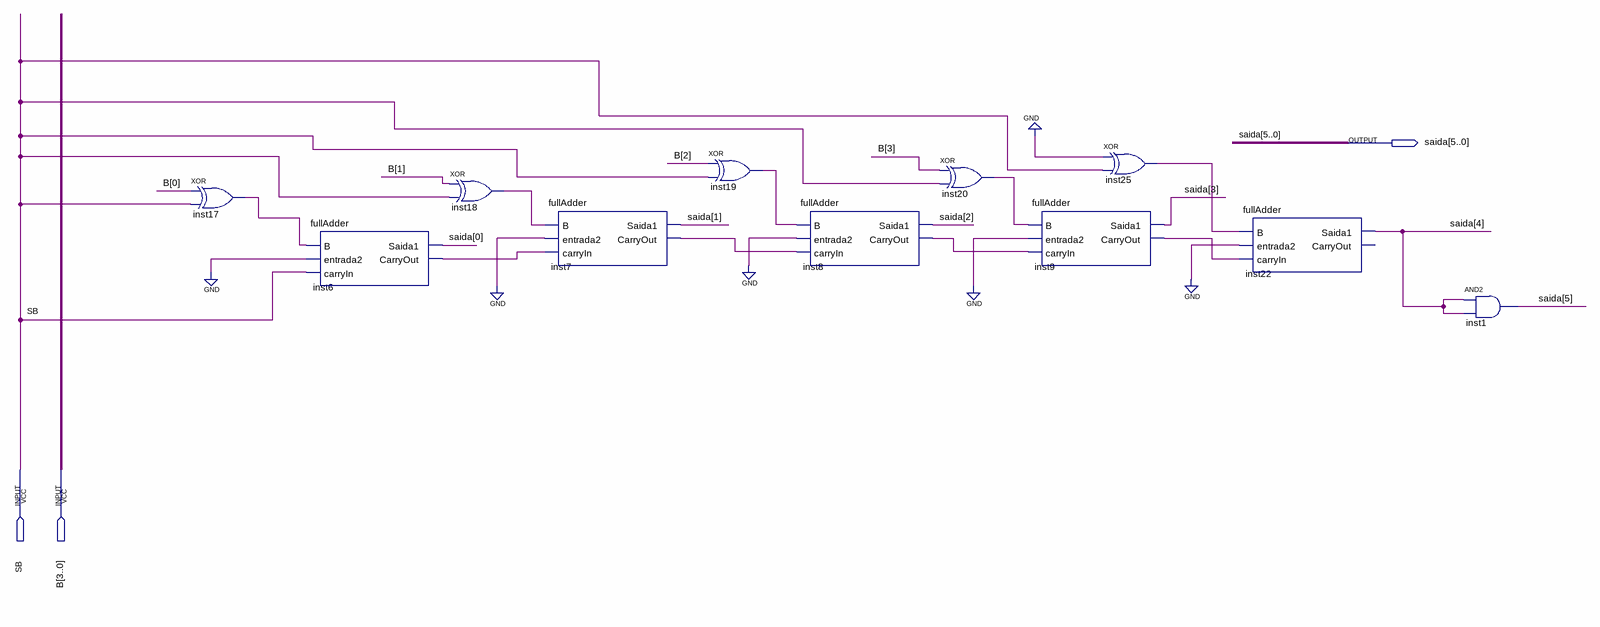
[diagram p0: schematic sheet]
// Quartus schematic comp2.bdf as structural Verilog: 11 symbols, 3 pins
module comp2 (
  input  SB,
  input  [3:0] B,
  output [5:0] saida
);

  wire inst6_carryout, inst7_carryout, inst8_carryout, inst9_carryout, inst17_out, inst18_out, inst19_out,
       inst20_out, inst25_out;

  xor inst17 (inst17_out, B[0], SB);
  fullAdder inst6 (.B(inst17_out), .entrada2(1'b0), .carryIn(SB), .Saida1(saida[0]), .CarryOut(inst6_carryout));
  xor inst18 (inst18_out, B[1], SB);
  fullAdder inst7 (
    .B(inst18_out), .entrada2(1'b0), .carryIn(inst6_carryout), .Saida1(saida[1]), .CarryOut(inst7_carryout));
  xor inst19 (inst19_out, B[2], SB);
  fullAdder inst8 (
    .B(inst19_out), .entrada2(1'b0), .carryIn(inst7_carryout), .Saida1(saida[2]), .CarryOut(inst8_carryout));
  xor inst20 (inst20_out, B[3], SB);
  fullAdder inst9 (
    .B(inst20_out), .entrada2(1'b0), .carryIn(inst8_carryout), .Saida1(saida[3]), .CarryOut(inst9_carryout));
  xor inst25 (inst25_out, 1'b0, SB);
  fullAdder inst22 (.B(inst25_out), .entrada2(1'b0), .carryIn(inst9_carryout), .Saida1(saida[4]));  // open: CarryOut
  and inst1 (saida[5], saida[4], saida[4]);
endmodule
